# EAGLE design Acceleration (EAGLE 7.2.0)
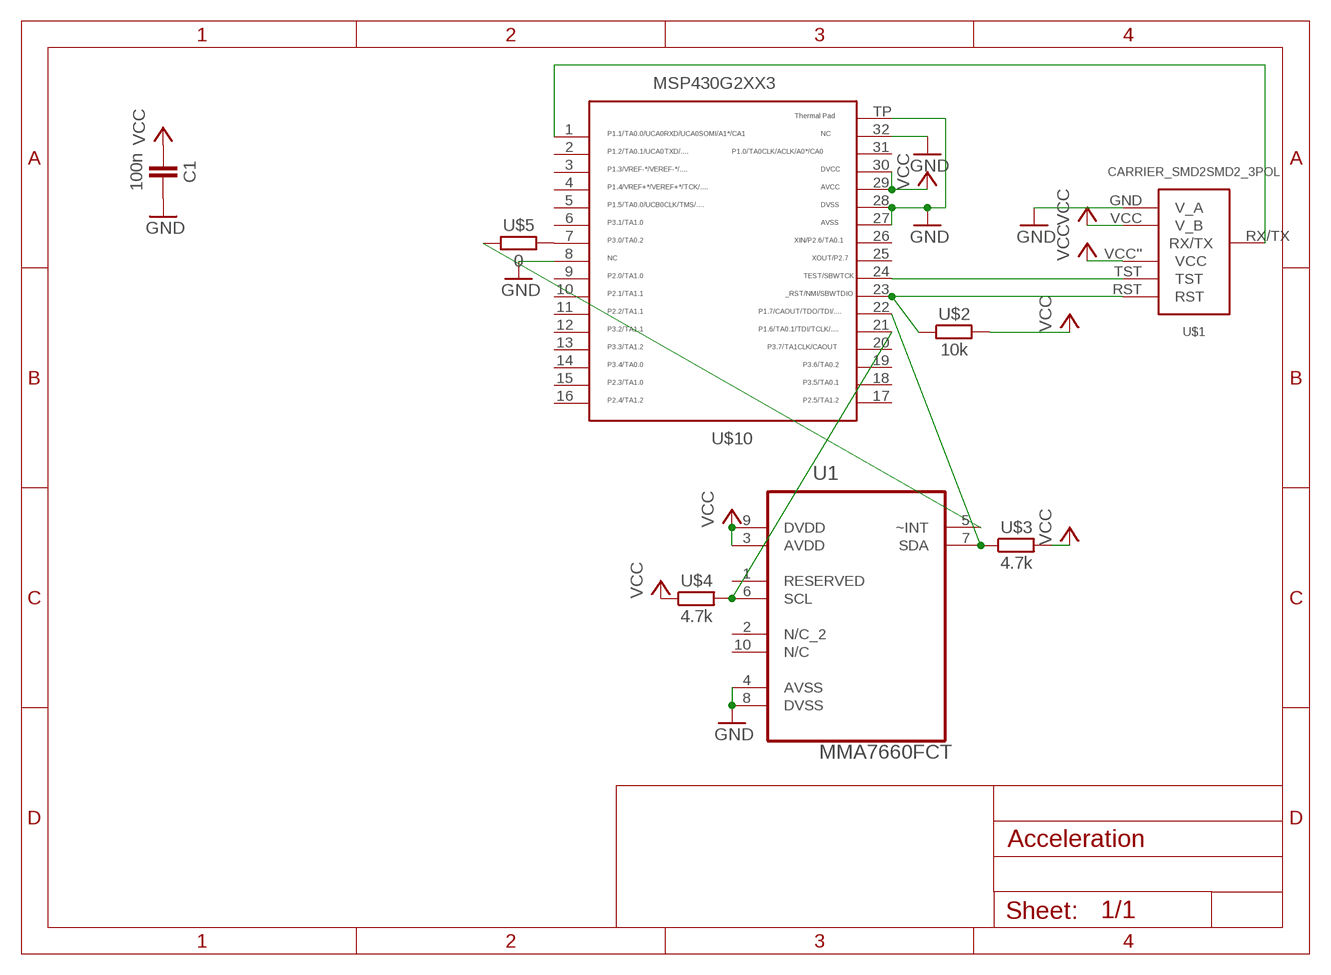
[diagram p0: schematic, sheet 1]

## Parts
C1  100n  CAPACITOR  [603]
U1  MMA7660FCT  [DFN300X300X100-10N]
U$1  CARRIER_SMD2SMD2_3POL  [CARRIER_SMD2_3POL]
U$2  10k  RESISTOR0603  [603]
U$3  4.7k  RESISTOR0603  [603]
U$4  4.7k  RESISTOR0603  [603]
U$5  0  RESISTOR1206  [1206]
U$10  MSP430G2553  [QFN32]

## Nets
GND: C1.2 U1.4(AVSS) U1.8(DVSS) U$1.GND(V_A) U$10.8 U$10.27 U$10.28 U$10.32 U$10.TP
N$2: U1.6(SCL) U$4.2 U$10.21
N$3: U$1.TST U$10.24
N$4: U$1.RST U$2.1 U$10.23
N$5: U1.7(SDA) U$3.1 U$10.22
N$6: U$5.2 U$10.7
N$7: U1.5(~INT) U$5.1
N$12: U$1.RX/TX U$10.1
VCC: C1.1 U1.3(AVDD) U1.9(DVDD) U$1.VCC''(VCC) U$1.VCC(V_B) U$2.2 U$3.2 U$4.1 U$10.29 U$10.30
Unconnected: U1.1(RESERVED) U1.2(N/C_2) U1.10(N/C) U$10.2 U$10.3 U$10.4 U$10.5 U$10.6 U$10.9 U$10.10 U$10.11 U$10.12 U$10.13 U$10.14 U$10.15 U$10.16 U$10.17 U$10.18 U$10.19 U$10.20 U$10.25 U$10.26 U$10.31

## Library data of the parts
C1 = thar:CAPACITOR
U1 = MMA7660:MMA7660FCT: Detection Sensor; MPN: MMA7660FCT; OC_FARNELL: 2238133; OC_NEWARK: 74P0443; PACKAGE: DFN-10; SUPPLIER: FREESCALE SEMICONDUCTOR
U$1 = thar:CARRIER_SMD2
U$2-U$5 = thar:RESISTOR
U$10 = thar:MSP430G2553: TEXAS INSTRUMENTS MSP430G2553IRHB32R MCU, 16BIT, MSP430, 16MHZ, QFN-32 Farnell Best.Nr.: 2325726 Herst.Bez.: MSP430G2553IRHB32R

## Board
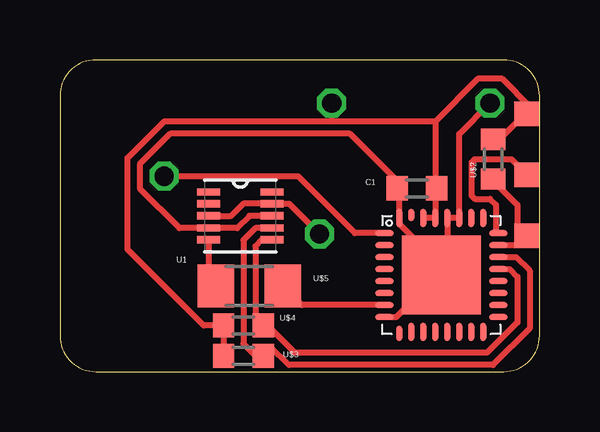
[diagram p1: board, top side]
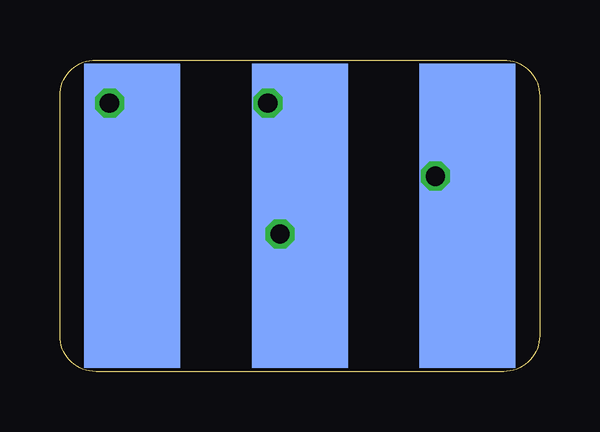
[diagram p2: board, bottom side, seen from below]

Size 20 x 13 mm. Coordinates in mm from the lower left corner, seen from the top.
Copper layers (1*16): Top 0.035mm / dielectric 1.5mm / Bottom 0.035mm
Design rules "Bilex DRU *": minimum track width 10mil, minimum drill 24mil, track to track 10mil, track to pad 10mil, pad to pad 10mil, via to via 10mil, smd to smd 10mil, copper to edge 1mil, drill to drill 8mil, minimum pad ring 10mil, minimum via ring 8mil, stop-mask expansion 4mil, vias tented up to drill 0mil, thermal gap 10mil

### Footprints (pad centres in the part's own frame; a part is rotated, then mirrored left to right if it is on the bottom)
603 = smd 0.889 x 1.016: 1 -0.826,0; 2 0.826,0
DFN300X300X100-10N = smd 0.965 x 0.305: 1 -1.321,0.991; 2 -1.321,0.508; 3 -1.321,0; 4 -1.321,-0.508; 5 -1.321,-0.991; 6 1.321,-0.991; 7 1.321,-0.508; 8 1.321,0; 9 1.321,0.508; 10 1.321,0.991
CARRIER_SMD2_3POL = smd 4 x 12.7 bottom: GND -6.985,0; RX/TX 6.985,0; VCC 0,0 | smd 1.016 x 1.016: RST -9.461,0.826; TST -9.461,-1.714; VCC'' -9.461,-4.255
1206 = smd 1.524 x 1.778: 1 -1.397,0; 2 1.397,0
QFN32 = smd 0.762 x 0.254: 1 -2.375,1.75; 2 -2.375,1.25; 3 -2.375,0.75; 4 -2.375,0.25; 5 -2.375,-0.25; 6 -2.375,-0.75; 7 -2.375,-1.25; 8 -2.375,-1.75; 17 2.375,-1.75; 18 2.375,-1.25; 19 2.375,-0.75; 20 2.375,-0.25; 21 2.375,0.25; 22 2.375,0.75; 23 2.375,1.25; 24 2.375,1.75 | smd 0.254 x 0.635: 9 -1.75,-2.438 | smd 0.254 x 0.762: 10 -1.25,-2.375; 11 -0.75,-2.375; 12 -0.25,-2.375; 13 0.25,-2.375; 14 0.75,-2.375; 15 1.25,-2.375; 16 1.75,-2.375; 25 1.75,2.375; 26 1.25,2.375; 27 0.75,2.375; 28 0.25,2.375; 29 -0.25,2.375; 30 -0.75,2.375; 32 -1.75,2.375 | smd 0.254 x 0.508: 31 -1.25,2.5 | smd 3.302 x 3.302: TP 0,0

### Placement (x,y rotation side)
C1  14.89,7.64 180 top
U1  7.52,6.5 0 top
U$1  10,6.5 180 top
U$2  18.06,8.86 90 top
U$3  7.65,0.66 180 top
U$4  7.65,1.92 0 top
U$5  7.9,3.58 0 top
U$10  15.9,4.03 0 top

### Tracks (layer width: path | path; a pad name or v marks a point on that pad's centre or on a via)
GND  (via drill 0.8)
  Top 0.254: 16.43,4.35 16.19,5.38 16.16,5.35 | 16.43,4.35 16.48,3.06 U$10.TP 15.01,2.94 14.89,3.14 14.03,2.28 U$10.8 | 16.15,4.72 U$10.28 U$10.27 16.65,9.91 v17.93,11.2 | 16.15,4.72 16.15,4.42 16.43,4.35 | 16.15,4.72 15.52,5.35 14.76,5.55 14.15,6.16 U$10.32 14.15,7.49 14,7.46 14.12,7.58 C1.2 13.87,7.64 | 13.87,7.64 14.12,7.26 | U1.8 7.9,6.5 7.39,5.99 U1.4 4.98,5.99 3.33,7.64 3.33,8.66 4.6,9.93 12.09,9.93 14.12,7.89 13.87,7.64
  Bottom 0.254: 18,6.5 17.93,6.57 v17.93,11.2 17.93,7.45 U$1.GND
N$2
  Top 0.254: U$10.21 18.75,4.28 19.08,3.96 19.08,2.05 17.81,0.78 9.81,0.78 8.66,1.92 U$4.2 8.16,1.99 8.16,5.23 8.44,5.51 U1.6
N$3
  Top 0.254: 19.61,7.88 19.46,8.02 19.5,8.18 | U$10.24 18.19,5.78 18.19,6.95 17.93,7.21 17.3,7.21 17.17,7.33 17.17,8.73 17.3,8.86 18.82,8.86 19.5,8.18 | 19.5,8.18 U$1.TST
N$4
  Top 0.254: 19.46,5.48 19.5,5.38 | 19.46,5.48 19.5,5.69 | 19.5,5.69 19.08,5.74 19.08,6.95 18.06,7.97 U$2.1 | U$10.23 19.28,5.28 19.46,5.48 | 19.5,5.69 19.48,5.69 U$1.RST
N$5
  Top 0.254: U$10.22 19.02,4.78 19.59,4.21 19.59,1.8 18.06,0.27 9.55,0.27 8.79,1.04 U$3.1 8.16,0.66 7.65,1.16 7.65,5.48 8.16,5.99 U1.7
N$6
  Top 0.254: U$10.7 10.1,2.78 U$5.2
N$7
  Top 0.254: U1.5 6.2,3.88 U$5.1
N$12  (via drill 0.8)
  Top 0.254: U$10.1 12.3,5.78 9.93,8.15 v4.35,8.15
  Bottom 0.254: U$1.RX/TX 4.35,7.83 v4.35,8.15
VCC  (via drill 0.8)
  Top 0.254: U$10.29 | 15.65,10.43 15.65,8.02 | 15.65,8.02 U$10.29 | 15.9,7.77 15.84,8.02 | 15.84,8.02 15.65,8.02 | U$10.29 U$10.30 | C1.1 15.84,8.02 | 19.5,10.52 19.46,10.56 | U$2.2 18.12,9.48 19.2,10.56 19.2,10.51 19.46,10.56 | 19.62,10.98 19.65,10.95 19.65,10.75 19.46,10.56 | 15.65,10.43 11.33,10.43 | 11.33,10.43 4.35,10.43 2.82,8.91 2.82,5.1 6,1.92 U$4.1 U$3.2 | U$1.VCC'' 19.46,10.82 19.62,10.98 | 19.62,10.98 19.62,11.03 18.44,12.21 17.43,12.21 15.65,10.43 | v11.33,11.2 11.33,10.43 | U1.3 7.14,6.5 7.65,7.01 U1.9 9.55,7.01 v10.82,5.74
  Bottom 0.254: v11.33,11.2 11.33,7.83 U$1.VCC 10.31,6.37 v10.82,5.74